# Altium schematic sheet nguon5v sch.SchDoc
size A
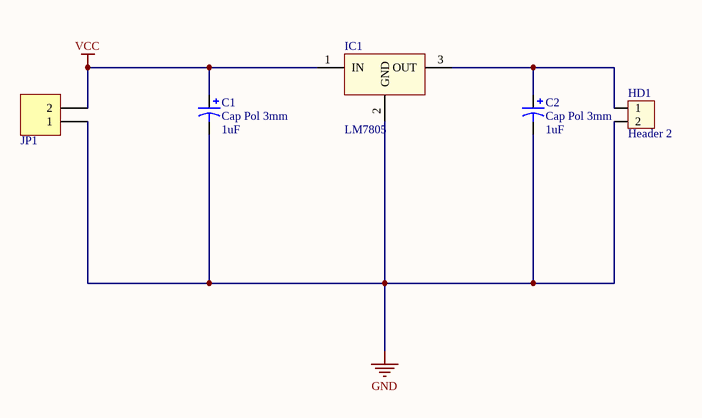
[diagram p0: nguon5v sch.SchDoc]

## Parts
C1  Cap Pol 3mm  [C3MM]
C2  Cap Pol 3mm  [C3MM]
HD1  Header 2  [HED2]
IC1  LM7805  [QTO-220]
JP1  Header 2_1  [HED2]  (value not drawn)

## Nets
GND: C1.2 C2.2 HD1.2 IC1.2(GND) JP1.1
VCC: C1.1 IC1.1(IN) JP1.2
NetC2_1: C2.1 HD1.1 IC1.3(OUT)

## Notes on the sheet
- (in symbol Cap Pol 3mm) 1uF

## Library data of the parts
C1 C2 = Cap Pol 3mm: Polarized Capacitor (Axial); Published: 8-Jun-2000; LatestRevisionDate: 17-Jul-2002; LatestRevisionNote: Re-released for DXP Platform.; PackageReference: POLAR0.8; Publisher: Altium Limited
HD1 = Hed2: Header 2 (Green); Value: Header 2
IC1 = LM78xx: On ap +, from + 5 to + 24VDC; Value: LM7805
JP1 = Header 2_1: Header, 2-Pin; Manufacturer: Generic Components; Class: Connector; Value: Header 2